# Altium schematic sheet part2.SchDoc
size A4; SheetNumber: 2; SheetTotal: 2
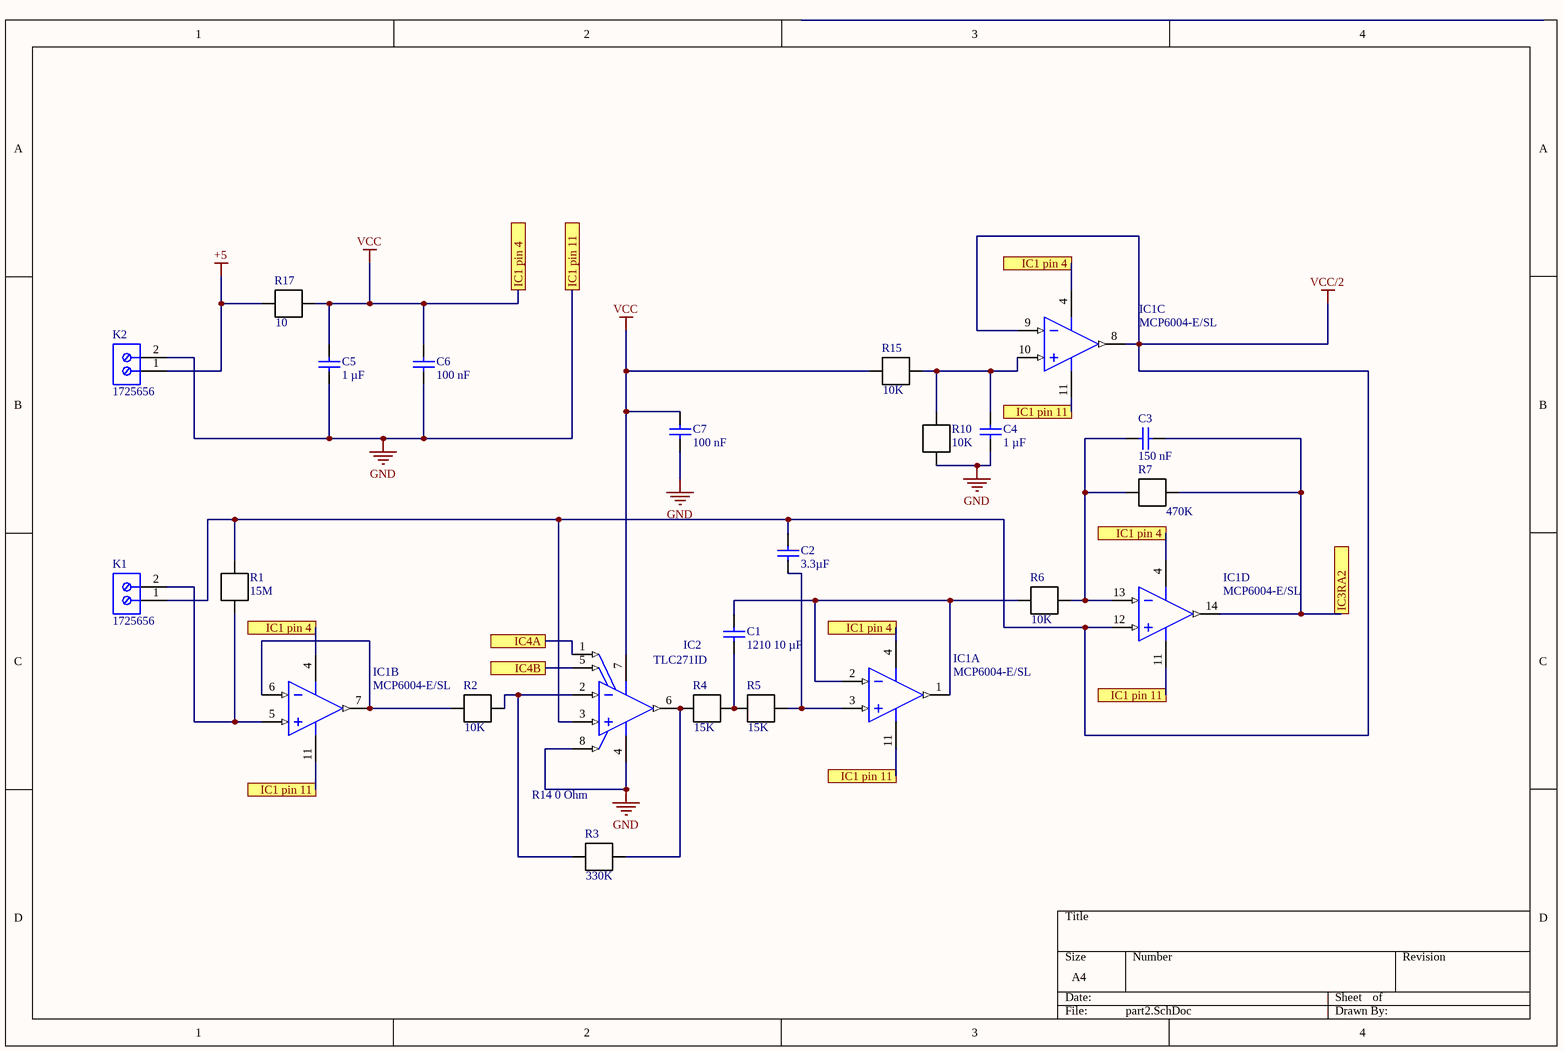
[diagram p0: part2.SchDoc]

## Parts
C1  1210 10 µF  [CAPC3225X279X50LL20T25]
C2  3.3µF  [CAPC1210(3225)280_N]
C3  150 nF  [CAPC2013X70X45NL10T25]
C4  1 µF  [CAPC2013X70X45NL10T25]
C5  1 µF  [CAPC2013X70X45NL10T25]
C6  100 nF  [CAPC2013X70X45NL10T25]
C7  100 nF  [CAPC2013X70X45NL10T25]
IC1  MCP6004-E/SL  [SOIC-SL14_M]  (parts A,B,C,D of 4)
IC2  TLC271ID  [D0008A_L]
K1  1725656  [PHOE-1725656-2]
K2  1725656  [PHOE-1725656-2]
R1  value 15M  [6-0805_M]
R2  value 10K  [6-0805_M]
R3  value 330K  [C1206]
R4  value 15K  [C1206]
R5  value 15K  [C1206]
R6  value 10K  [6-0805_M]
R7  value 470K  [C1206]
R10  value 10K  [6-0805_M]
R15  value 10K  [6-0805_M]
R17  value 10  [6-0805_M]

## Ports
IC1 pin 4, IC1 pin 11, IC3RA2, IC4A, IC4B

## Nets
+5: K2.1 R17.1
GND: C4.1 C5.1 C6.1 C7.1 IC1.11(VSS) IC2.4(GND) IC2.8(BIAS_SELECT) K2.2 R10.1 ; port IC1 pin 11
VCC: C5.2 C6.2 C7.2 IC1.4(VDD) IC2.7(VDD) R15.1 R17.2 ; port IC1 pin 4
VCC/2: C2.2 IC1.8(VOUTC) IC1.9(VINC-) IC1.12(VIND+) IC2.3(IN+) K1.1 R1.2
IC3RA2: C3.1 IC1.14(VOUTD) R7.2 ; port IC3RA2
IC4A: IC2.1(OFFSET_N1) ; port IC4A
IC4B: IC2.5(OFFSET_N2) ; port IC4B
NetC1_1: C1.1 R4.2 R5.1
NetC1_2: C1.2 IC1.1(VOUTA) IC1.2(VINA-) R6.1
NetC2_1: C2.1 IC1.3(VINA+) R5.2
NetC3_2: C3.2 IC1.13(VIND-) R6.2 R7.1
NetC4_2: C4.2 IC1.10(VINC+) R10.2 R15.2
NetIC1_5: IC1.5(VINB+) K1.2 R1.1
NetIC1_6: IC1.6(VINB-) IC1.7(VOUTB) R2.1
NetIC2_2: IC2.2(IN-) R2.2 R3.1
NetIC2_6: IC2.6(OUT) R3.2 R4.1

## Notes on the sheet
- R14 0 Ohm

## Library data of the parts
C1 = CMP-2000-05477-1: Chip Capacitor, 10 uF, +/- 10%, 25 V, -55 to 85 degC, 1210 (3225 Metric), RoHS, Tape and Reel; Manufacturer: AVX; Product Training Modules: ComponentSolutionsforSmartMeterApplications; Capacitance: 10µF; Catalog Drawings: AT2A_1210_2.79; Voltage - Rated: 25V; Other Names: 478-1627-6; Online Catalog: X5RDielectric(D); Temperature Coefficient: X5R; Package Reference: 1210; Lead Style: -; Manufacturer URL: http://www.avx.com/; Datasheet Version: 05/2016; Ratings: -; Mounting Technology: SurfaceMount; Datasheet URL: http://datasheets.avx.com/cx5r.pdf; Package Description: 2-Pin Surface Mount Device, Body 3.2 x 2.5 mm; Applications: GeneralPurpose; Features: -; Tolerance: ±10%; Package / Case: 1210(3225Metric); Lead Spacing: -; Series: -; Mounting Type: SurfaceMount,MLCC; Family: CeramicCapacitors; Standard Package: 1; Category: Capacitors; Packaging: Digi-Reel®; Thickness (Max): 0.110"(2.79mm); Operating Temperature: -55°C~85°C; Size / Dimension: 0.126"Lx0.098"W(3.20mmx2.50mm); Height - Seated (Max): -
C2 = CMP-1038-02104-1: CAP 2.2uF 100V ±10% 1210 (3225 Metric) Thickness 2.8mm SMD; Case-Metric: 3225; Tolerance: Â±10%; Case-EIA: 1210; Rated Voltage: 100 V; Value: 3.3µF; Technology: SMT; Max Thickness: 2.8 mm
C3-C7 = CMP-2007-00889-1: Manufacturer: Murata; Part Number: GRM2165C1H332JA01D
IC1 = CMP-0187-00279-2: 1 MHz, Low-Power Operational Amplifier, 14-Pin SOIC, Extended Temperature; PackageVersion: revBB, Aug-2009; ComponentLink3URL: http://www.microchip.com/stellent/groups/techpub_sg/documents/packagingspec/en012702.pdf; ComponentLink1URL: http://www.microchip.com/; Code_IPC: SOIC127P600-14; ComponentLink1Description: Manufacturer URL; PackageDescription: 14-Lead Plastic Small Outline (SL) - Narrow, 3.90mm Body [SOIC]; RevisionNote: URLs added.; ComponentLink2Description: Datasheet; ComponentLink3Description: Package Specification; DatasheetVersion: revJ, Nov-2009; ComponentLink2URL: http://ww1.microchip.com/downloads/en/DeviceDoc/21733j.pdf; Code_JEDEC: MS-012-AB; PackageReference: SOIC-SL14
IC2 = CMP-0017-00249-2: LinCMOS(TM) Programmable Low-Power Operational Amplifier, 4 to 16 V, -40 to 85 degC, 8-pin SOIC (D8), Green (RoHS & no Sb/Br); Manufacturer: Texas Instruments; Sub Family: General Purpose Amplifier; Slew Rate(Typ)(V/us): 3.6; Total Supply Voltage(Max)(+5V is 5, +/-5V is 10): 16; Iq per channel(Max)(mA): 1.6; Vio (25C)(Max)(mV): 10; Total Supply Voltage(Min)(+5V is 5, +/-5V is 10): 4; GBW(Typ)(MHz): 1.7; Number of Channels: 1; IIB(Max)(pA): 60; CMRR(Min)(dB): 65; Vn at 1kHz(Typ)(nV/rtHz): 25; Rating: Military; Offset Drift(Typ)(uV/C): 1.8; PackageDescription: 8-Pin Plastic Small Outline, Body 4.9 x 3.9 mm, Pitch 1.27 mm; PackageReference: D0008A; PackageVersion: 4040047-3/M, 06/2011; ComponentLink1Description: Manufacturer URL; ComponentLink3URL: http://www.ti.com/litv/pdf/msoi002j; ComponentLink2URL: http://www.ti.com/lit/ds/symlink/tlc271.pdf; Eco-Plan: Green (RoHS & no Sb/Br); DatasheetVersion: SLOS090D; ComponentLink3Description: Package Specification; Code_JEDEC: MS-012; PartNumber: TLC271ID; ComponentLink1URL: http://www.ti.com/; Mounting Technology: Surface Mount; ComponentLink2Description: Datasheet
K1 K2 = CMP-2000-05299-1: Male Header, Pitch 2.54 mm, 1 x 2 Position, Height 9 mm, Tail Length 3.5 mm; Manufacturer: Phoenix Contact; Number of contacts: 2; Content: 250pc(s); Pitch: 2.54mm; Industrial packaging: Yes; Colour: Green; Manufacturer part No.: 1725656; Type: MPT0,5/2-2,54; Datasheet URL: http://datasheet.octopart.com/1725656-Phoenix-Contact-datasheet-5302866.pdf; Manufacturer URL: http://www.phoenixcontact.com/; Datasheet Version: Apr-08
R1-R7 R10 R15 R17 = Res1: Resistor; Published: 8-Jun-2000; LatestRevisionDate: 17-Jul-2002; LatestRevisionNote: Re-released for DXP Platform.; PackageReference: AXIAL-0.3; Publisher: Altium Limited; PackageDescription: Axial Device, Thru-Hole; 2 Leads; 0.3 in Pin Spacing; Supplier 1: RSComponents